# Altium schematic sheet Toplevel.SchDoc
size A
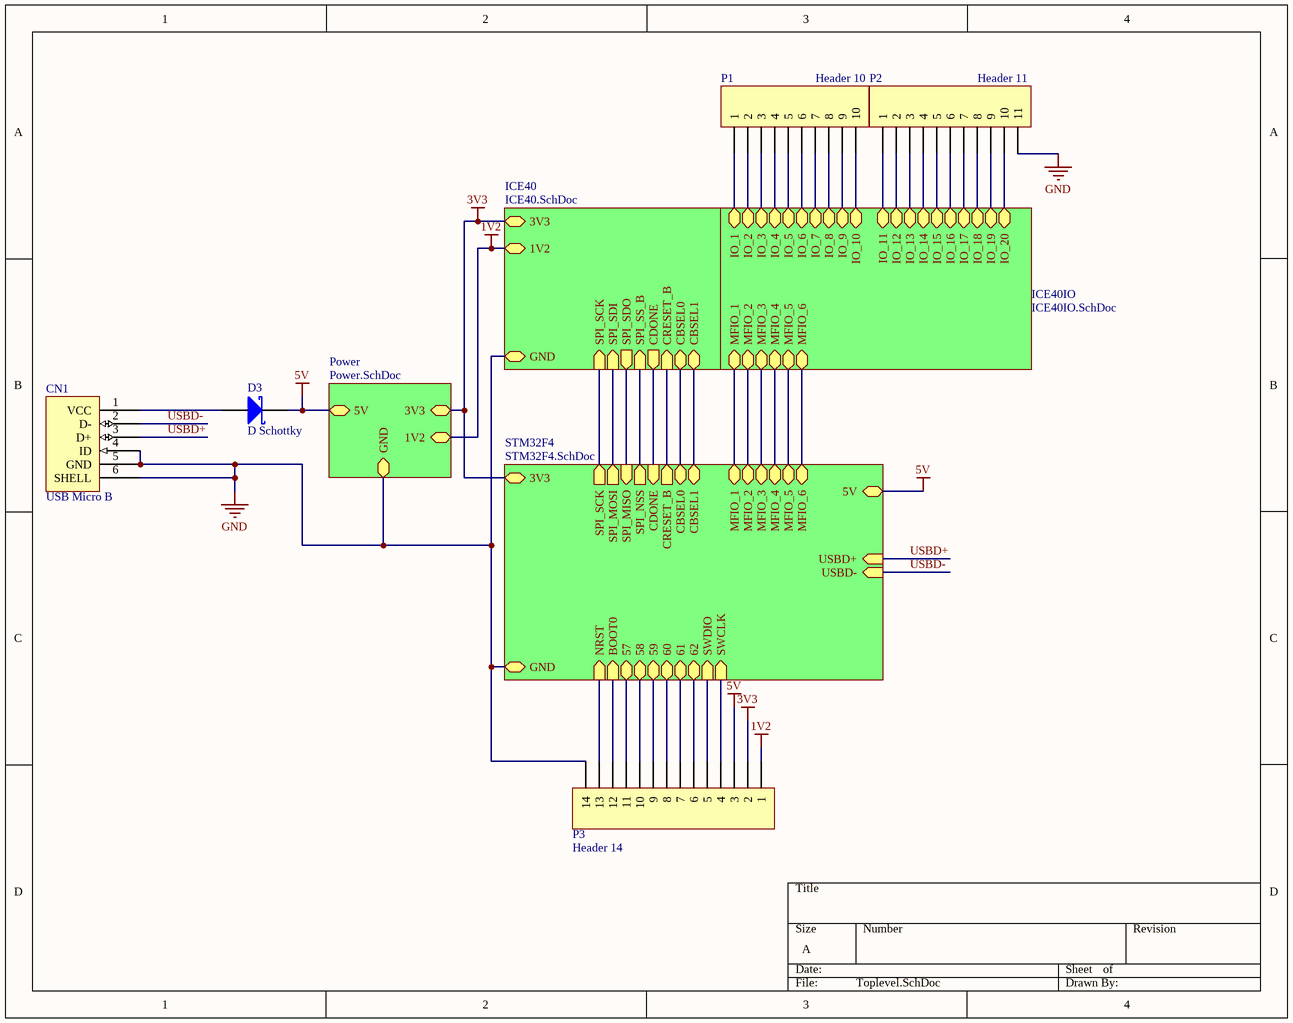
[diagram p0: Toplevel.SchDoc]

## Parts
CN1  USB Micro B
D3  D Schottky  [SMB]
P1  Header 10  [HDR1X10]
P2  Header 11  [HDR1X11]
P3  Header 14  [HDR1X14]

## Sub-sheets
ICE40 = ICE40.SchDoc: 3V3, 1V2, GND, SPI_SCK (in), SPI_SDI (in), SPI_SDO (out), SPI_SS_B (in), CDONE (out), CRESET_B (in), CBSEL1 (bidir), CBSEL0 (bidir)
ICE40IO = ICE40IO.SchDoc: MFIO_1 (bidir), MFIO_2 (bidir), MFIO_3 (bidir), MFIO_4 (bidir), MFIO_6 (bidir), IO_1 (bidir), IO_2 (bidir), IO_3 (bidir), IO_4 (bidir), IO_5 (bidir), IO_6 (bidir), IO_8 (bidir), IO_9 (bidir), IO_10 (bidir), IO_12 (bidir), IO_13 (bidir), IO_11 (bidir), IO_14 (bidir), IO_15 (bidir), IO_16 (bidir), IO_17 (bidir), IO_18 (bidir), IO_19 (bidir), IO_20 (bidir), IO_7 (bidir), MFIO_5 (bidir)
Power = Power.SchDoc: GND, 5V, 3V3, 1V2
STM32F4 = STM32F4.SchDoc: SPI_SCK (out), SPI_MOSI (out), SPI_MISO (in), SPI_NSS (out), CDONE (in), CRESET_B (out), CBSEL0 (bidir), CBSEL1 (bidir), MFIO_1 (bidir), MFIO_2 (bidir), MFIO_3 (bidir), MFIO_4 (bidir), MFIO_5 (bidir), MFIO_6 (bidir), NRST (in), BOOT0 (in), 57 (bidir), 58 (bidir), 59 (bidir), 60 (bidir), 61 (bidir), 62 (bidir), 3V3, GND, USBD+ (in), USBD- (in), SWCLK (in), SWDIO (in), 5V

## Nets
1V2: P3.1 ; sheet Power/1V2, sheet ICE40/1V2
3V3: P3.2 ; sheet Power/3V3, sheet ICE40/3V3, sheet STM32F4/3V3
5V: D3.2(K) P3.3 ; sheet Power/5V, sheet STM32F4/5V
GND: CN1.4(ID) CN1.5(GND) CN1.6(SHELL) P2.11 P3.14 ; sheet Power/GND, sheet ICE40/GND, sheet STM32F4/GND
USBD+: CN1.3(D+) ; sheet STM32F4/USBD+
USBD-: CN1.2(D-) ; sheet STM32F4/USBD-
NetCN1_1: CN1.1(VCC) D3.1(A)
NetP1_1: P1.1 ; sheet ICE40IO/IO_1
NetP1_2: P1.2 ; sheet ICE40IO/IO_2
NetP1_3: P1.3 ; sheet ICE40IO/IO_3
NetP1_4: P1.4 ; sheet ICE40IO/IO_4
NetP1_5: P1.5 ; sheet ICE40IO/IO_5
NetP1_6: P1.6 ; sheet ICE40IO/IO_6
NetP1_7: P1.7 ; sheet ICE40IO/IO_7
NetP1_8: P1.8 ; sheet ICE40IO/IO_8
NetP1_9: P1.9 ; sheet ICE40IO/IO_9
NetP1_10: P1.10 ; sheet ICE40IO/IO_10
NetP2_1: P2.1 ; sheet ICE40IO/IO_11
NetP2_2: P2.2 ; sheet ICE40IO/IO_12
NetP2_3: P2.3 ; sheet ICE40IO/IO_13
NetP2_4: P2.4 ; sheet ICE40IO/IO_14
NetP2_5: P2.5 ; sheet ICE40IO/IO_15
NetP2_6: P2.6 ; sheet ICE40IO/IO_16
NetP2_7: P2.7 ; sheet ICE40IO/IO_17
NetP2_8: P2.8 ; sheet ICE40IO/IO_18
NetP2_9: P2.9 ; sheet ICE40IO/IO_19
NetP2_10: P2.10 ; sheet ICE40IO/IO_20
NetP3_4: P3.4 ; sheet STM32F4/SWCLK
NetP3_5: P3.5 ; sheet STM32F4/SWDIO
NetP3_6: P3.6 ; sheet STM32F4/62
NetP3_7: P3.7 ; sheet STM32F4/61
NetP3_8: P3.8 ; sheet STM32F4/60
NetP3_9: P3.9 ; sheet STM32F4/59
NetP3_10: P3.10 ; sheet STM32F4/58
NetP3_11: P3.11 ; sheet STM32F4/57
NetP3_12: P3.12 ; sheet STM32F4/BOOT0
NetP3_13: P3.13 ; sheet STM32F4/NRST
(unnamed): sheet ICE40/SPI_SCK, sheet STM32F4/SPI_SCK
(unnamed): sheet ICE40/SPI_SDI, sheet STM32F4/SPI_MOSI
(unnamed): sheet ICE40/SPI_SDO, sheet STM32F4/SPI_MISO
(unnamed): sheet ICE40/SPI_SS_B, sheet STM32F4/SPI_NSS
(unnamed): sheet ICE40/CDONE, sheet STM32F4/CDONE
(unnamed): sheet ICE40/CRESET_B, sheet STM32F4/CRESET_B
(unnamed): sheet ICE40/CBSEL1, sheet STM32F4/CBSEL1
(unnamed): sheet ICE40/CBSEL0, sheet STM32F4/CBSEL0
(unnamed): sheet ICE40IO/MFIO_1, sheet STM32F4/MFIO_1
(unnamed): sheet ICE40IO/MFIO_2, sheet STM32F4/MFIO_2
(unnamed): sheet ICE40IO/MFIO_3, sheet STM32F4/MFIO_3
(unnamed): sheet ICE40IO/MFIO_4, sheet STM32F4/MFIO_4
(unnamed): sheet ICE40IO/MFIO_6, sheet STM32F4/MFIO_6
(unnamed): sheet ICE40IO/MFIO_5, sheet STM32F4/MFIO_5

## Library data of the parts
CN1 = USB Micro B: Manuf_Part_1: 5075BMR-05-SM; Order: 5075BMR-05-SM; ECCN: ????
D3 = D Schottky: Schottky Diode; Published: 8-Jun-2000; LatestRevisionDate: 17-Jul-2002; LatestRevisionNote: Re-released for DXP Platform.; PackageReference: SMB; Publisher: Altium Limited; PackageDescription: DO-214-AA/SMB; 2 C-Bend Leads; Body 5.3 x 3.6 mm, inc. leads (LxW); Code_JEDEC: DO-214-AA
P1 = Header 10: Header, 10-Pin; LatestRevisionDate: 17-Jul-2002; LatestRevisionNote: Re-released for DXP Platform.; Publisher: Altium Limited
P2 = Header 11: Header, 11-Pin; LatestRevisionDate: 17-Jul-2002; LatestRevisionNote: Re-released for DXP Platform.; Publisher: Altium Limited
P3 = Header 14: Header, 14-Pin; LatestRevisionDate: 17-Jul-2002; LatestRevisionNote: Re-released for DXP Platform.; Publisher: Altium Limited